# Altium schematic sheet omnibothub-power-one-usb.SchDoc
size A4
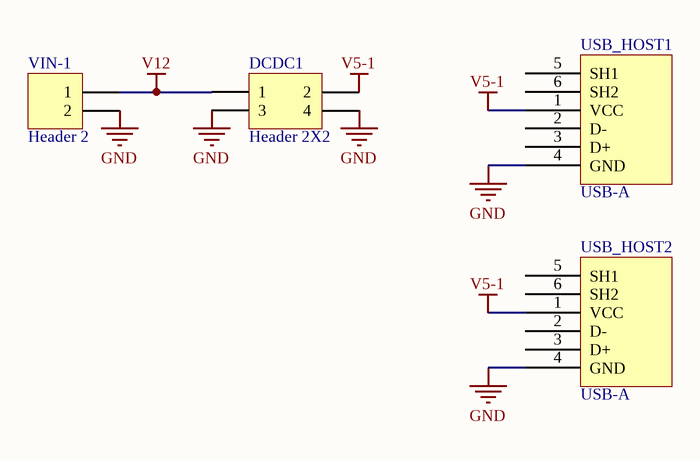
[diagram p0: omnibothub-power-one-usb.SchDoc]

## Parts
DCDC1  Header 2X2  [DCDC-1]
USB_HOST1  USB-A  [614004135023]
USB_HOST2  USB-A  [614004135023]
VIN-1  Header 2  [AMASS-XT30PW-M]

## Nets
GND: DCDC1.3 DCDC1.4 USB_HOST1.4(GND) USB_HOST2.4(GND) VIN-1.2
V5-1: DCDC1.2 USB_HOST1.1(VCC) USB_HOST2.1(VCC)
V12: DCDC1.1 VIN-1.1

Not connected (* = marked no-connect by the designer): USB_HOST1 2(D-) 3(D+) 5(SH1) 6(SH2); USB_HOST2 2(D-) 3(D+) 5(SH1) 6(SH2)

## Library data of the parts
DCDC1 = Header 2X2: Header, 2-Pin, Dual row; LatestRevisionDate: 17-Jul-2002; LatestRevisionNote: Re-released for DXP Platform.; Publisher: Altium Limited
VIN-1 = Header 2: Header, 2-Pin; LatestRevisionDate: 17-Jul-2002; LatestRevisionNote: Re-released for DXP Platform.; Publisher: Altium Limited